# Altium schematic sheet MCU.SchDoc
size A4
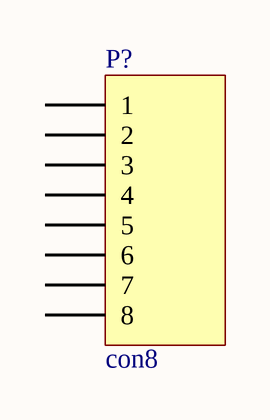
[diagram p0: MCU.SchDoc]

## Parts
P?  con8  [691305140008]

## Nets

Not connected (* = marked no-connect by the designer): P? 1 2 3 4 5 6 7 8

## Library data of the parts
P? = con8: System: Connector